# EAGLE design bekono_mini (EAGLE 7.2.0)
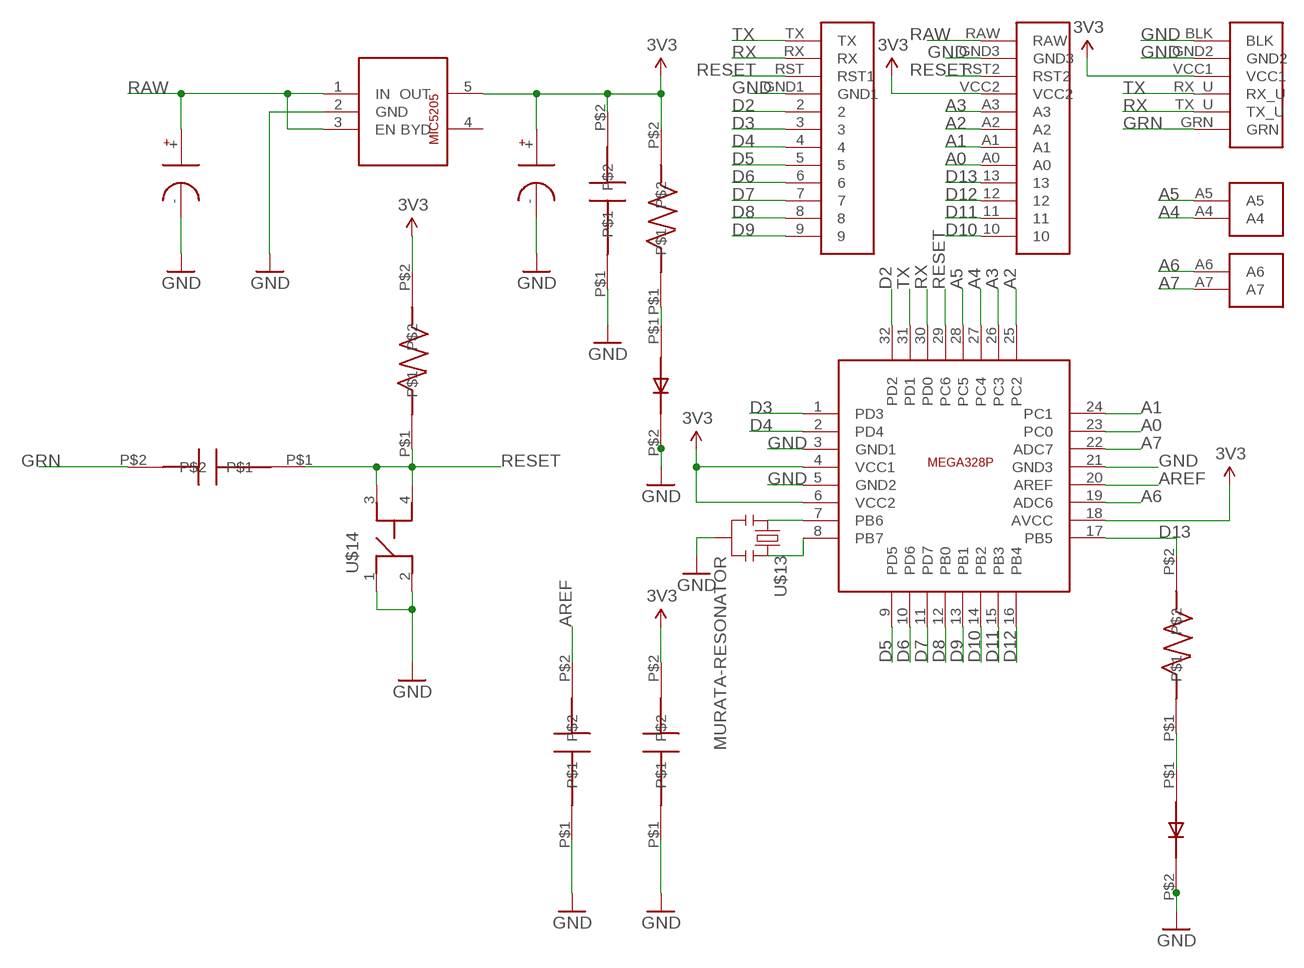
[diagram p0: schematic, sheet 1]

## Parts
U$1  ARDUIN-MINIPRO-BASE  [ARDUINO-MINIPRO-BASE]
U$2  MICREL-MIC5205  [MICREL-MIC5205]
U$3  TANTALUM-CAPACITOR-1206  [TANTALUM-CAPACITOR-1206]
U$4  TANTALUM-CAPACITOR-1206  [TANTALUM-CAPACITOR-1206]
U$5  CAPACITOR-0603  [0603]
U$6  RESISTOR-0603  [0603]
U$7  LED-0603  [0603]
U$8  ATMEL-MEGA328P  [ATNEL-MEGA328P]
U$9  RESISTOR-0603  [0603]
U$10  LED-0603  [0603]
U$11  CAPACITOR-0603  [0603]
U$12  CAPACITOR-0603  [0603]
U$13  MURATA-RESONATOR  [MURATA-RESONATOR]
U$14  SWITCH-LS6J2M-T  [SWITCH-LS6J2M-T]
U$15  RESISTOR-0603  [0603]
U$16  CAPACITOR-0603  [0603]

## Nets
3V3: U$1.VCC1 U$1.VCC2 U$2.5(OUT) U$4.+ U$5.P$2 U$6.P$2 U$8.4(VCC1) U$8.6(VCC2) U$8.18(AVCC) U$11.P$2 U$15.P$2
A0: U$1.A0 U$8.23(PC0)
A1: U$1.A1 U$8.24(PC1)
A2: U$1.A2 U$8.25(PC2)
A3: U$1.A3 U$8.26(PC3)
A4: U$1.A4 U$8.27(PC4)
A5: U$1.A5 U$8.28(PC5)
A6: U$1.A6 U$8.19(ADC6)
A7: U$1.A7 U$8.22(ADC7)
AREF: U$8.20(AREF) U$12.P$2
D2: U$1.2 U$8.32(PD2)
D3: U$1.3 U$8.1(PD3)
D4: U$1.4 U$8.2(PD4)
D5: U$1.5 U$8.9(PD5)
D6: U$1.6 U$8.10(PD6)
D7: U$1.7 U$8.11(PD7)
D8: U$1.8 U$8.12(PB0)
D9: U$1.9 U$8.13(PB1)
D10: U$1.10 U$8.14(PB2)
D11: U$1.11 U$8.15(PB3)
D12: U$1.12 U$8.16(PB4)
D13: U$1.13 U$8.17(PB5) U$9.P$2
GND: U$1.BLK U$1.GND1 U$1.GND2 U$1.GND3 U$2.2(GND) U$3.- U$4.- U$5.P$1 U$7.P$2 U$8.3(GND1) U$8.5(GND2) U$8.21(GND3) U$10.P$2 U$11.P$1 U$12.P$1 U$13.2 U$14.1 U$14.2
GRN: U$1.GRN U$16.P$2
N$1: U$6.P$1 U$7.P$1
N$2: U$8.7(PB6) U$13.1
N$3: U$9.P$1 U$10.P$1
N$4: U$8.8(PB7) U$13.3
RAW: U$1.RAW U$2.1(IN) U$2.3(EN) U$3.+
RESET: U$1.RST2 U$1.RST(RST1) U$8.29(PC6) U$14.3 U$14.4 U$15.P$1 U$16.P$1
RX: U$1.RX U$1.TX_U U$8.30(PD0)
TX: U$1.RX_U U$1.TX U$8.31(PD1)
Unconnected: U$2.4(BYD)

## Library data of the parts
U$1 = gclueParts:ARDUIN-MINIPRO-BASE
U$2 = gclueParts:MICREL-MIC5205
U$3 U$4 = gclueParts:TANTALUM-CAPACITOR-1206
U$5 U$11 U$12 U$16 = gclueParts:CAPACITOR-0603
U$6 U$9 U$15 = gclueParts:RESISTOR-0603
U$7 U$10 = gclueParts:LED-0603
U$8 = gclueCPU:ATMEL-MEGA328P
U$13 = gclueParts:MURATA-RESONATOR
U$14 = gclueParts:SWITCH-LS6J2M-T

## Board
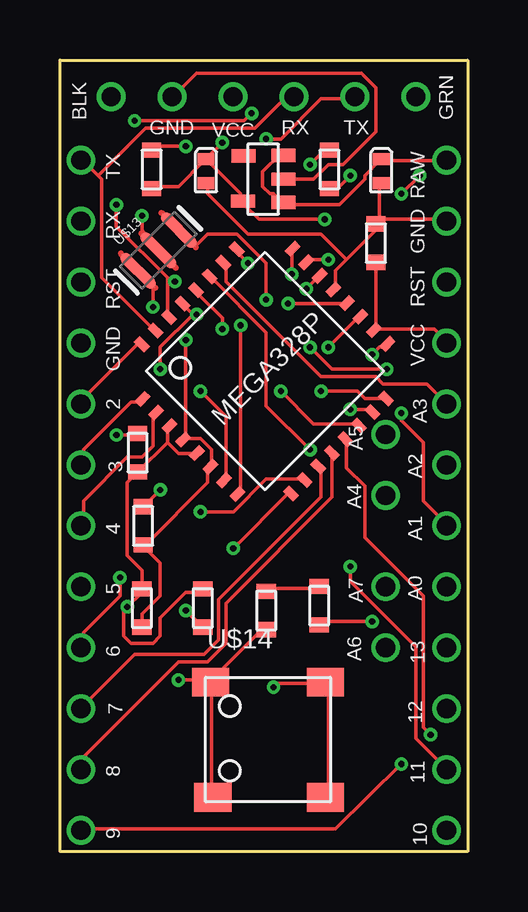
[diagram p1: board, top side]
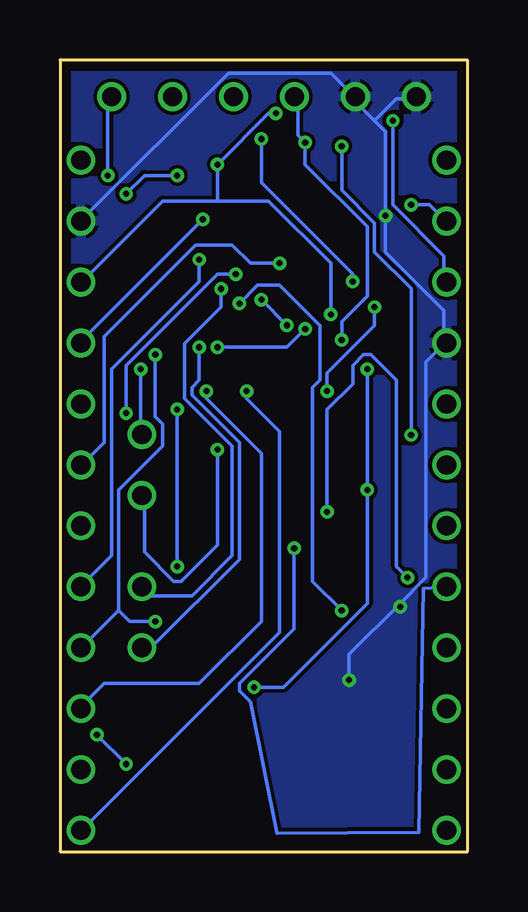
[diagram p2: board, bottom side, seen from below]

Size 17 x 33 mm. Coordinates in mm from the lower left corner, seen from the top.
Copper layers (1*16): Top 0.035mm / dielectric 1.5mm / Bottom 0.035mm
Design rules "default *": minimum track width 6mil, minimum drill 10mil, track to track 6mil, track to pad 6mil, pad to pad 6mil, via to via 6mil, smd to smd 6mil, copper to edge 15mil, drill to drill 6mil, minimum pad ring 6mil, minimum via ring 6mil, stop-mask expansion 4mil, vias tented up to drill 0mil, thermal gap 6mil

### Footprints (pad centres in the part's own frame; a part is rotated, then mirrored left to right if it is on the bottom)
ARDUINO-MINIPRO-BASE = drill 0.8: 2 -7.625,2.16; 3 -7.625,-0.38; 4 -7.625,-2.92; 5 -7.625,-5.46; 6 -7.625,-8; 7 -7.625,-10.54; 8 -7.625,-13.08; 9 -7.625,-15.62; 10 7.625,-15.62; 11 7.625,-13.08; 12 7.625,-10.54; 13 7.625,-8; A0 7.625,-5.46; A1 7.625,-2.92; A2 7.625,-0.38; A3 7.625,2.16; A4 5.085,-1.65; A5 5.085,0.89; A6 5.085,-8; A7 5.085,-5.46; BLK -6.36,14.975; GND1 -7.625,4.7; GND2 -3.82,14.975; GND3 7.625,9.78; GRN 6.34,14.975; RAW 7.625,12.32; RST -7.625,7.24; RST2 7.625,7.24; RX -7.625,9.78; RX_U 1.26,14.975; TX -7.625,12.32; TX_U 3.8,14.975; VCC1 -1.28,14.975; VCC2 7.625,4.7
MICREL-MIC5205 = smd 0.55 x 1: 1 -0.97,-0.85; 2 0,-0.85; 3 0.99,-0.85; 4 0.97,0.82; 5 -0.92,0.84
TANTALUM-CAPACITOR-1206 = smd 0.7 x 0.5: + 0,0.5; - 0,-0.5
0603 = smd 0.8 x 0.635: P$1 0,0.8; P$2 0,-0.8
ATNEL-MEGA328P = smd 0.6 x 0.35: 1 -4.43,2.79; 2 -4.43,1.99; 3 -4.43,1.19; 4 -4.43,0.39; 5 -4.43,-0.41; 6 -4.43,-1.21; 7 -4.43,-2.01; 8 -4.43,-2.81; 17 4.42,-2.81; 18 4.42,-2.01; 19 4.42,-1.21; 20 4.42,-0.41; 21 4.42,0.39; 22 4.42,1.19; 23 4.42,1.99; 24 4.42,2.79 | smd 0.35 x 0.6: 9 -2.84,-4.38; 10 -2.04,-4.38; 11 -1.24,-4.38; 12 -0.44,-4.38; 13 0.36,-4.38; 14 1.16,-4.38; 15 1.96,-4.38; 16 2.76,-4.38; 25 2.76,4.42; 26 1.96,4.42; 27 1.16,4.42; 28 0.36,4.42; 29 -0.44,4.42; 30 -1.24,4.42; 31 -2.04,4.42; 32 -2.84,4.42
MURATA-RESONATOR = smd 0.45 x 1.905: 1 -1.2,0; 2 0,0; 3 1.2,0
SWITCH-LS6J2M-T = smd 1.55 x 1.2: 1 -2.4,2.4; 2 -2.3,-2.4; 3 2.4,2.4; 4 2.4,-2.4

### Placement (x,y rotation side)
U$1  8.5,16.5 0 top
U$2  8.47,28.03 90 top
U$3  13.4,28.36 0 top
U$4  6.09,28.36 0 top
U$5  3.42,10.15 0 top
U$6  3.83,28.44 0 top
U$7  3.24,16.63 0 top
U$8  8.55,20.03 45 top
U$9  10.81,10.25 0 top
U$10  8.6,10.05 0 top
U$11  13.17,25.36 0 top
U$12  5.96,10.15 0 top
U$13  4.11,25.06 45 top
U$14  8.68,4.66 0 top
U$15  3.47,13.58 0 top
U$16  11.24,28.44 0 top

### Tracks (layer width: path | path; a pad name or v marks a point on that pad's centre or on a via)
3V3  (via drill 0.25)
  Top 0.152: 5.25,17.21 5.86,17.21 6.32,16.75 6.32,16.14 U$8.6 6.16,15.99 6.16,15.38 3.57,12.79 U$15.P$2 3.57,12.64 4.18,12.03 4.18,10.66 3.42,9.9 U$5.P$2 | U$11.P$2 13.17,21.78 | 13.17,21.78 15.61,21.78 16.07,21.33 U$1.VCC2 | 13.17,21.78 U$8.18 | U$4.+ 6.16,28.79 7.53,27.42 7.53,27.12 U$2.5 7.69,26.96 8.3,26.35 v11.04,26.35 | U$6.P$2 3.88,27.73 4.94,27.73 6.01,28.79 U$4.+ | v6.77,29.56 6.16,28.95 U$4.+ | v5.25,21.33 5.25,17.21 | 5.25,17.21 U$8.4
  Bottom 0.152: U$1.VCC1 7.08,31.38 7.08,29.86 v6.77,29.56 6.77,28.64 4.18,26.05 4.18,23.15 5.25,22.09 v5.25,21.33 | v11.04,26.35 16.07,21.33 U$1.VCC2
A0  (via drill 0.25)
  Top 0.152: v11.19,24.68 10.28,24.68 U$8.23
  Bottom 0.152: v11.19,24.68 11.19,23.76 14.85,20.11 14.85,12.33 16.07,11.11 U$1.A0
A1  (via drill 0.25)
  Top 0.152: v9.67,24.07 9.67,24.98 U$8.24 | v14.24,18.28 14.24,17.97 15.15,17.06 15.15,14.62 16.07,13.71 U$1.A1
  Bottom 0.152: v9.67,24.07 10.43,24.07 14.24,20.26 v14.24,18.28
A2  (via drill 0.25)
  Top 0.152: v7.84,24.53 7.38,24.98 U$8.25
  Bottom 0.152: v7.84,24.53 9.06,24.53 9.82,25.29 11.34,25.29 15.15,21.48 15.15,17.06 16.07,16.14 U$1.A2
A3
  Top 0.152: U$8.26 6.92,24.53 6.92,23.76 10.89,19.8 13.17,19.8 13.48,19.5 15.31,19.5 16.07,18.73 U$1.A3
A4  (via drill 0.25)
  Top 0.152: v10.43,16.75 8.6,18.58 8.6,21.63 6.32,23.92 U$8.27
  Bottom 0.152: v10.43,16.75 10.43,12.79 11.95,11.27 12.26,11.27 13.48,12.49 13.48,14.77 U$1.A4
A5  (via drill 0.25)
  Top 0.152: v6.77,21.78 6.77,22.24 5.71,23.31 U$8.28 | v10.43,21.02 11.34,20.11 v13.63,20.11
  Bottom 0.152: v6.77,21.78 7.53,21.02 v10.43,21.02 | v13.63,20.11 13.63,17.52 U$1.A5
A6  (via drill 0.25)
  Top 0.152: v11.19,21.02 12.41,22.24 U$8.19
  Bottom 0.152: v11.19,21.02 11.19,19.65 11.5,19.34 11.5,19.04 9.52,17.06 9.52,12.18 13.17,8.52 13.48,8.52 U$1.A6
A7  (via drill 0.25)
  Top 0.152: v10.28,23.46 10.73,23.92 U$8.22
  Bottom 0.152: v10.28,23.46 10.28,22.7 11.8,21.17 11.8,18.89 9.82,16.91 9.82,12.33 11.5,10.66 13.17,10.66 13.48,10.96 U$1.A7
AREF  (via drill 0.25)
  Top 0.152: v9.52,22.85 11.95,22.85 U$8.20 | v5.25,10.05 5.86,9.44 U$12.P$2
  Bottom 0.152: v9.52,22.85 8.75,23.61 7.84,23.61 6.16,21.94 6.16,19.65 6.47,19.34 6.47,11.27 v5.25,10.05
D2
  Top 0.152: U$8.32 3.27,21.17 0.83,18.73 U$1.2
D3
  Top 0.152: U$8.1 3.42,18.73 2.96,18.73 0.98,16.75 0.98,16.14 U$1.3
D4
  Top 0.152: U$8.2 3.88,18.28 3.88,16.91 3.42,16.45 2.81,16.45 0.98,14.62 0.98,13.71 U$1.4
D5  (via drill 0.25)
  Top 0.152: v7.23,12.64 9.52,14.92 U$8.9
  Bottom 0.152: v7.23,12.64 7.23,9.29 9.52,7 9.52,6.7 9.06,6.24 7.94,0.75 2.02,0.8 1.84,10.96 U$1.5
D6  (via drill 0.25)
  Top 0.152: v5.86,14.16 7.23,14.16 8.6,15.53 10.13,15.53 U$8.10 | v2.51,11.42 2.51,10.66 0.98,9.13 0.98,8.52 U$1.6
  Bottom 0.152: v5.86,14.16 5.86,18.43 4.79,19.5 4.79,20.26 4.33,20.72 4.03,20.72 2.96,19.65 2.96,11.88 v2.51,11.42
D7
  Top 0.152: U$8.11 10.89,15.99 10.89,14.77 6.62,10.51 6.62,8.83 6.01,8.22 3.11,8.22 0.98,6.09 U$1.7
D8
  Top 0.152: U$8.12 11.34,16.6 11.34,14.77 6.92,10.35 6.92,8.68 6.16,7.91 4.94,7.91 0.98,3.95 0.98,3.49 U$1.8
D9  (via drill 0.25)
  Top 0.152: v15.46,4.87 15.15,5.17 15.15,10.66 12.72,13.1 12.72,15.23 11.95,15.99 11.95,17.06 U$8.13 | v14.24,3.65 11.5,0.95 0.98,0.95 U$1.9
  Bottom 0.152: v14.24,3.65 v15.46,4.87
D10  (via drill 0.25)
  Top 0.152: v9.21,19.19 10.58,17.82 12.41,17.82 U$8.14
  Bottom 0.152: v9.21,19.19 9.21,18.89 7.84,17.52 7.84,9.13 16.07,0.9 U$1.10
D11  (via drill 0.25)
  Top 0.152: v12.11,18.43 13.02,18.43 U$8.15 | v12.11,11.88 12.11,11.27 14.85,8.52 14.85,4.71 16.07,3.49 U$1.11
  Bottom 0.152: v12.11,11.88 v12.11,18.43
D12  (via drill 0.25)
  Top 0.152: v10.89,19.19 12.41,19.19 12.72,18.89 13.48,18.89 U$8.16
  Bottom 0.152: v10.89,19.19 10.89,18.89 8.6,16.6 8.6,9.59 11.19,7 15.15,7 16.07,6.09 U$1.12
D13  (via drill 0.25)
  Top 0.152: v13.02,20.72 13.33,21.02 13.63,21.02 U$8.17 | v13.02,9.59 10.89,9.59 U$9.P$2
  Bottom 0.152: v13.02,20.72 13.02,18.13 12.72,17.82 12.72,16.91 14.54,15.08 14.54,10.05 | 14.54,10.05 16.07,8.52 U$1.13 | v13.02,9.59 14.09,9.59 14.54,10.05
GND  (via drill 0.25)
  Top 0.152: 11.95,24.68 13.17,25.9 U$11.P$1 | 11.95,24.68 11.5,24.22 11.5,23.46 U$8.21 | 11.95,24.68 10.89,25.75 7.84,25.75 6.16,27.42 6.16,27.73 U$4.- | 13.33,26.35 13.33,27.73 U$3.- | 13.33,26.35 13.17,26.2 U$11.P$1 | 13.33,26.35 16.07,26.35 U$1.GND3 | 13.33,26.35 U$11.P$1 | 4.49,17.06 4.94,16.6 U$8.5 | 4.49,17.06 4.49,17.67 U$8.3 | 4.49,17.06 3.27,15.84 U$7.P$2 3.11,15.69 2.81,15.38 2.81,12.33 3.42,11.72 U$5.P$1 3.42,10.81 v2.81,10.2 2.66,10.05 2.66,8.98 2.96,8.68 3.88,8.68 4.18,8.98 4.18,9.74 5.25,10.81 5.86,10.81 U$12.P$1 | U$10.P$2 8.6,9.13 8.3,9.13 6.32,7.15 U$14.1 | U$14.2 6.32,2.28 6.32,7 U$14.1 | U$2.2 10.58,28.03 11.19,28.64 11.8,28.64 13.17,30.01 13.17,31.84 12.56,32.45 5.71,32.45 4.79,31.54 U$1.GND2 | v3.42,26.51 3.42,25.9 U$13.2 | v4.94,7.15 6.16,7.15 U$14.1
  Bottom 0.152: 3.88,30.47 4.79,31.38 U$1.GND2 4.79,31.54 5.71,32.45 9.97,32.45 16.07,26.35 U$1.GND3 | 3.88,30.47 3.42,30.01 v3.42,26.51 3.42,24.98 0.98,22.54 0.98,21.33 U$1.GND1 0.98,21.17 1.74,20.41 1.74,11.42 2.81,10.35 | 3.88,30.47 2.96,31.38 2.2,31.38 U$1.BLK | v4.94,7.15 4.94,8.22 2.81,10.35 | 2.81,10.35 v2.81,10.2
  pour Bottom: -0.59,-0.54 17.85,-0.54 17.85,33.37 -0.67,33.37 -0.67,-0.39
GRN  (via drill 0.25)
  Top 0.152: v12.11,28.18 11.65,27.73 11.34,27.73 U$16.P$2 | v15,28.18 v14.24,27.42
  Bottom 0.152: v12.11,28.18 13.48,28.18 v14.24,27.42 | v15,28.18 15,31.23 14.85,31.38 U$1.GRN
N$1  (via drill 0.25)
  Top 0.152: v2.35,17.36 3.11,17.36 U$7.P$1 | v5.25,29.4 4.03,29.4 3.88,29.25 U$6.P$1
  Bottom 0.152: v2.35,17.36 2.35,23.46 3.88,24.98 3.88,26.2 5.25,27.57 v5.25,29.4
N$2  (via drill 0.25)
  Top 0.152: v5.86,19.19 6.92,18.13 6.92,15.53 U$8.7 | v3.88,22.7 3.88,23.46 3.98,23.49
  Bottom 0.152: v5.86,19.19 5.86,19.95 3.88,21.94 v3.88,22.7
N$3
  Top 0.152: U$10.P$1 8.6,10.96 10.73,10.96 U$9.P$1
N$4  (via drill 0.25)
  Top 0.152: v7.53,21.94 7.53,14.92 U$8.8 | v8.6,23 8.6,24.53 7.38,25.75 6.16,25.75 5.71,25.29 5.67,25.19
  Bottom 0.152: v8.6,23 v7.53,21.94
RAW
  Top 0.152: U$2.3 9.21,29.1 8.45,28.34 8.45,27.73 8.75,27.42 8.91,27.42 9.21,27.12 U$2.1 9.36,26.96 11.65,26.96 12.72,28.03 12.72,28.18 13.33,28.79 U$3.+ 13.48,28.79 16.07,28.79 U$1.RAW
RESET  (via drill 0.25)
  Top 0.152: U$14.4 11.19,2.28 11.19,7 U$14.3 11.04,7 9.06,7 v8.91,6.85 | 5.55,22.39 5.25,22.7 U$8.29 | v4.18,15.08 3.57,14.47 U$15.P$1 | v4.18,20.11 4.18,21.02 5.55,22.39 | 5.55,22.39 v5.71,22.39 | v10.43,28.64 10.89,29.1 11.19,29.1 U$16.P$1 | v3.11,30.47 7.69,30.47 v7.99,30.77
  Bottom 0.152: v5.71,22.39 5.71,24.53 8.3,27.12 10.43,27.12 | 10.43,27.12 12.72,27.12 16.07,23.76 U$1.RST2 | v4.18,20.11 v4.18,15.08 4.18,10.35 7.69,6.85 v8.91,6.85 | 10.43,27.12 v10.43,28.64 8.3,30.77 v7.99,30.77 | v3.11,30.47 3.11,26.96 0.98,24.83 0.98,23.76 U$1.RST
RX  (via drill 0.25)
  Top 0.152: 4.49,23.76 4.49,23.92 2.35,26.05 v2.35,26.96 | 4.49,23.76 4.49,22.39 U$8.30 | v8.6,29.71 9.21,29.71 10.89,31.38 12.26,31.38 U$1.TX_U | 4.49,23.76 v4.79,23.76
  Bottom 0.152: v2.35,26.96 1.59,26.96 0.98,26.35 U$1.RX | v8.6,29.71 8.6,27.88 4.79,24.07 v4.79,23.76
TX
  Top 0.152: 1.59,28.18 0.98,28.79 U$1.TX | 1.59,28.18 1.74,28.03 1.74,23.92 3.88,21.78 U$8.31 | 1.59,28.18 3.57,30.16 8.14,30.16 9.36,31.38 9.67,31.38 U$1.RX_U